# EAGLE schematic rgbstripe_msgeq7 (EAGLE 9.6.2)
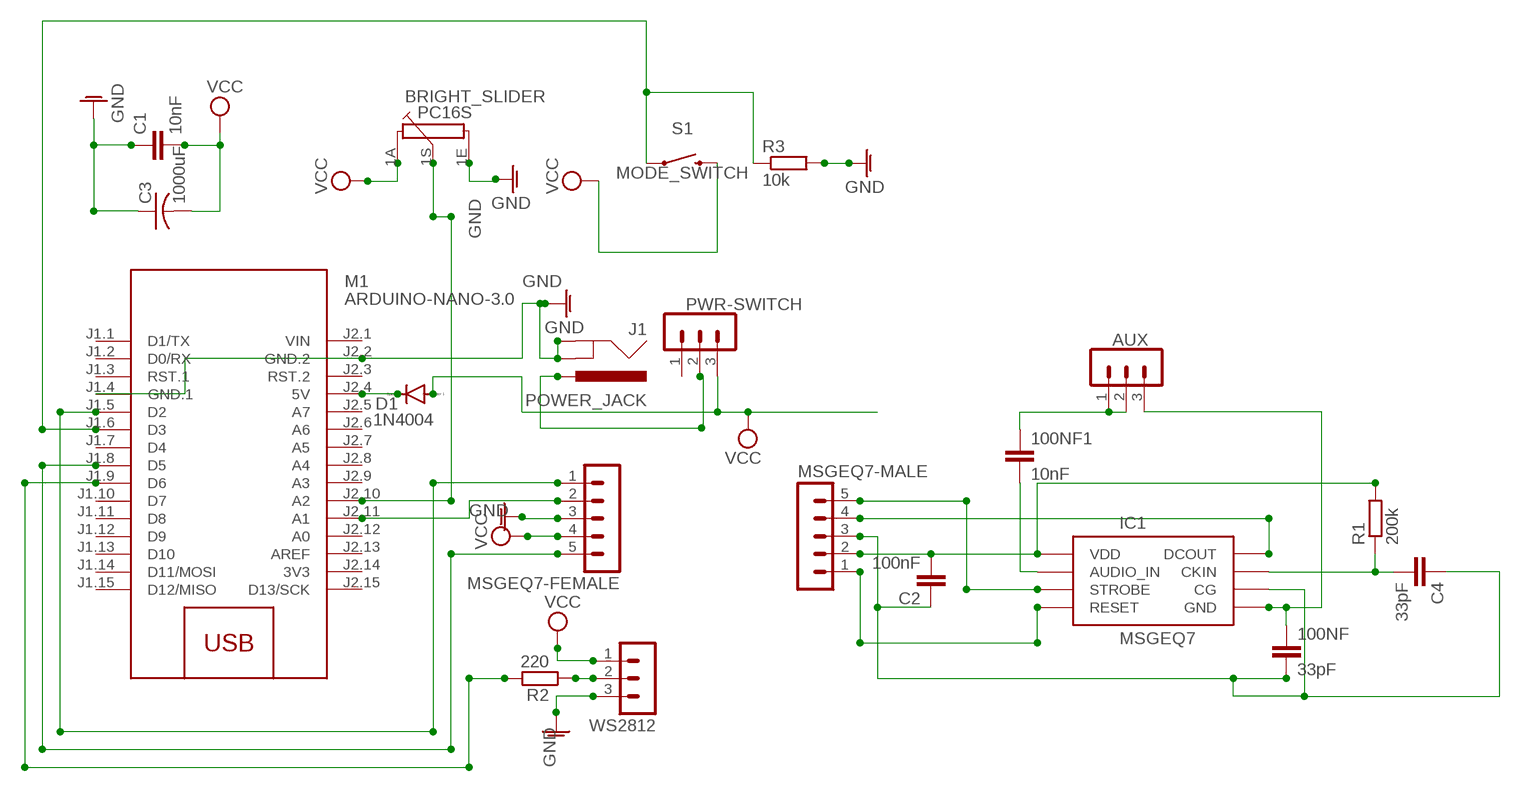
[diagram p0: schematic, sheet 1]

## Parts
100NF  33pF  C-EU025-025X050  [C025-025X050]
100NF1  10nF  C-EU025-025X050  [C025-025X050]
AUX  MA03-1  [MA03-1]
BRIGHT_SLIDER  PC16S  [PC16S]
C1  10nF  C-EU025-025X050  [C025-025X050]
C2  100nF  C-EU025-025X050  [C025-025X050]
C3  1000uF  C-US050-024X044  [C050-024X044]
C4  33pF  C-EU025-025X050  [C025-025X050]
D1  1N4004  [DO41-10]
IC1  MSGEQ7P  MSGEQ7DIL  [DIP08]
J1  POWER_JACK  [POWER_JACK_PTH]
M1  ARDUINO-NANO-3.0  [ARDUINO-NANO-3.0]
MSGEQ7-FEMALE  MA05-1  [MA05-1]
MSGEQ7-MALE  MA05-1  [MA05-1]
PWR-SWITCH  MA03-1  [MA03-1]
R1  200k  R-EU_0204/5  [0204/5]
R2  220  R-EU_0204/5  [0204/5]
R3  10k  R-EU_0204/5  [0204/5]
S1  MODE_SWITCH  MOMENTARY-SWITCH-SPST-PTH-12MM  [TACTILE_SWITCH_PTH_12MM]
WS2812  MA03-1  [MA03-1]

## Nets
GND: BRIGHT_SLIDER.1E C1.1 C3.1 J1.GND J1.GNDBREAK M1.J1.4(GND.1) M1.J2.2(GND.2) MSGEQ7-FEMALE.3 R3.2 WS2812.3
N$1: D1.C M1.J2.4(5V)
N$2: M1.J1.8(D5) MSGEQ7-FEMALE.5
N$3: M1.J2.11(A1) MSGEQ7-FEMALE.2
N$4: M1.J1.5(D2) MSGEQ7-FEMALE.1
N$5: C2.2 IC1.1(VDD) MSGEQ7-MALE.2 R1.2
N$6: 100NF.2 C2.1 C4.1 IC1.6(CG) MSGEQ7-MALE.3
N$7: IC1.3(DCOUT) MSGEQ7-MALE.4
N$8: IC1.4(STROBE) MSGEQ7-MALE.5
N$9: IC1.7(RESET) MSGEQ7-MALE.1
N$10: 100NF1.1 AUX.1 AUX.2
N$11: C4.2 IC1.8(CKIN) R1.1
N$12: 100NF.1 AUX.3 IC1.2(GND)
N$13: 100NF1.2 IC1.5(AUDIO_IN)
N$14: M1.J1.9(D6) R2.2
N$15: BRIGHT_SLIDER.1S M1.J2.10(A2)
N$16: R2.1 WS2812.2
N$17: M1.J1.6(D3) R3.1 S1.1
N$19: J1.PWR PWR-SWITCH.2
VCC: BRIGHT_SLIDER.1A C1.2 C3.2 D1.A MSGEQ7-FEMALE.4 PWR-SWITCH.3 S1.3 WS2812.1
Unconnected: M1.J1.1(D1/TX) M1.J1.2(D0/RX) M1.J1.3(RST.1) M1.J1.7(D4) M1.J1.10(D7) M1.J1.11(D8) M1.J1.12(D9) M1.J1.13(D10) M1.J1.14(D11/MOSI) M1.J1.15(D12/MISO) M1.J2.3(RST.2) M1.J2.5(A7) M1.J2.6(A6) M1.J2.7(A5) M1.J2.8(A4) M1.J2.9(A3) M1.J2.12(A0) M1.J2.13(AREF) M1.J2.15(D13/SCK) PWR-SWITCH.1

## Power pins joined to a net without a drawn wire
3V3: M1.J2.14(3V3)
VIN: M1.J2.1(VIN)

## Library data of the parts
100NF 100NF1 C1 C2 C4 = resistor:C-EU: CAPACITOR, European symbol
AUX PWR-SWITCH WS2812 = con-lstb:MA03-1: PIN HEADER; OC_FARNELL: unknown; OC_NEWARK: unknown
BRIGHT_SLIDER = piher:PC16S: POTENTIOMETER single carbon potentiometer, 16 mm, S3ROH; OC_FARNELL: 4452940; OC_NEWARK: unknown
C3 = resistor:C-US: CAPACITOR, American symbol
D1 = diode:1N4004: DIODE general purpose rectifier, 1 A
IC1 = SparkFun-IC-Special-Function:MSGEQ7: 7-band graphic equalizer This IC is for making a 7 band/channel audio spectrometer. There are two versions of this part. The DIP available on the storefront, and the SO used in product. Datasheet <https://www.sparkfun.com/datasheets/Components/General/MSGEQ7.pdf> SparkFun Products Storefront component: Graphic Equalizer Display Filter - MSGEQ7 <https://www.sparkfun.com/products/10468> (COM-10468) SparkFun Spectrum Shield <https://www.sparkfun.com/products/13116> (DEV-13116); PROD_ID: IC-12196
J1 = SparkFun-Connectors:POWER_JACK: Power Jack Connector This is the standard 5.5mm barrel jack for power. The PTH is the most common, proven, reliable, footprint. The Slot footprint only works if the mill layer is transmitted to the PCB fab house so be warned. Here are the connectors we sell at SparkFun: DC Barrel Power Jack/Connector <https://www.sparkfun.com/products/119> (PRT-00119) DC Barrel Power Jack/Connector (SMD) <https://www.sparkfun.com/products/12748> (PRT-12748) DC Barrel Jack Adapter - Breadboard Compatible <https://www.sparkfun.com/products/10811> (PRT-10811) It is used on this SparkFun product (and many, many others): SparkFun RedBoard - Programmed with Arduino <https://www.sparkfun.com/products/12757> (DEV-12757) Also, if you need a mating power supply or connector, please check these out: Wall Adapter Power Supply - 9VDC 650mA <https://www.sparkfun.com/products/298> (TOL-00298) DC Barrel Jack Adapter - Male <https://www.sparkfun.com/products/10287> (PRT-10287); PROD_ID: CONN-08197
M1 = diy-modules:ARDUINO-NANO-3.0: Arduino Nano 3.0 and compatible devices More details available here: https://www.arduino.cc/en/Main/ArduinoBoardNano Click here to find device on ebay.com <http://www.ebay.com/sch/arduino+nano>
MSGEQ7-FEMALE MSGEQ7-MALE = con-lstb:MA05-1: PIN HEADER; OC_FARNELL: unknown; OC_NEWARK: unknown
R1-R3 = resistor:R-EU_: RESISTOR, European symbol
S1 = SparkFun-Switches:MOMENTARY-SWITCH-SPST: Momentary Switch (Pushbutton) - SPST Normally-open (NO) SPST momentary switches (buttons, pushbuttons). Variants PTH-12MM - 12mm square, through-hole Momentary Pushbutton Switch - 12mm Square <https://www.sparkfun.com/products/9190> (COM-09190) PTH-6.0MM, PTH-6.0MM-KIT - 6.0mm square, through-hole Mini Pushbutton Switch <https://www.sparkfun.com/products/97> (COM-00097) KIT package intended for soldering kit's - only one side of pads' copper is exposed. PTH-RIGHT-ANGLE-KIT - Right-angle, through-hole Right Angle Tactile Button <https://www.sparkfun.com/products/10791> - Used on SparkFun BigTime Watch Kit <https://www.sparkfun.com/products/11734> SMD-12MM - 12mm square, surface-mount Tactile Button - SMD (12mm) <https://www.sparkfun.com/products/12993> (COM-12993) Used on SparkFun PicoBoard <https://www.sparkfun.com/products/11888> SMD-4.5MM - 4.5mm Square Trackball Switch Used on SparkFun Blackberry Trackballer Breakout <https://www.sparkfun.com/products/13169> SMD-4.6MMX2.8MM - 4.60mm x 2.80mm, surface mount Used on SparkFun SAMD21 Mini Breakout <https://www.sparkfun.com/products/13664> SMD-5.2MM, SMD-5.2-REDUNDANT - 5.2mm square, surface-mount Mini Pushbutton Switch - SMD <https://www.sparkfun.com/products/8720> (COM-08720) Used on Arduino Pro Mini <https://www.sparkfun.com/products/11114> REDUNDANT package connects both switch circuits together SMD-6.0X3.5MM - 6.0 x 3.5mm, surface mount Momentary Reset Switch SMD <https://www.sparkfun.com/products/8229> (COM-08229) SMD-6.2MM-TALL - 6.2mm square, surface mount Tactile Button - SMD (6mm) <https://www.sparkfun.com/products/12992> Used on SparkFun Digital Sandbox <https://www.sparkfun.com/products/12651> SMD-RIGHT-ANGLE - Right-angle, surface mount Used on SparkFun Block for Intel® Edison - Arduino <https://www.sparkfun.com/products/13036>; PROD_ID: SWCH-09185; SF_SKU: COM-09190